# Altium schematic sheet schematic.SchDoc
size Letter
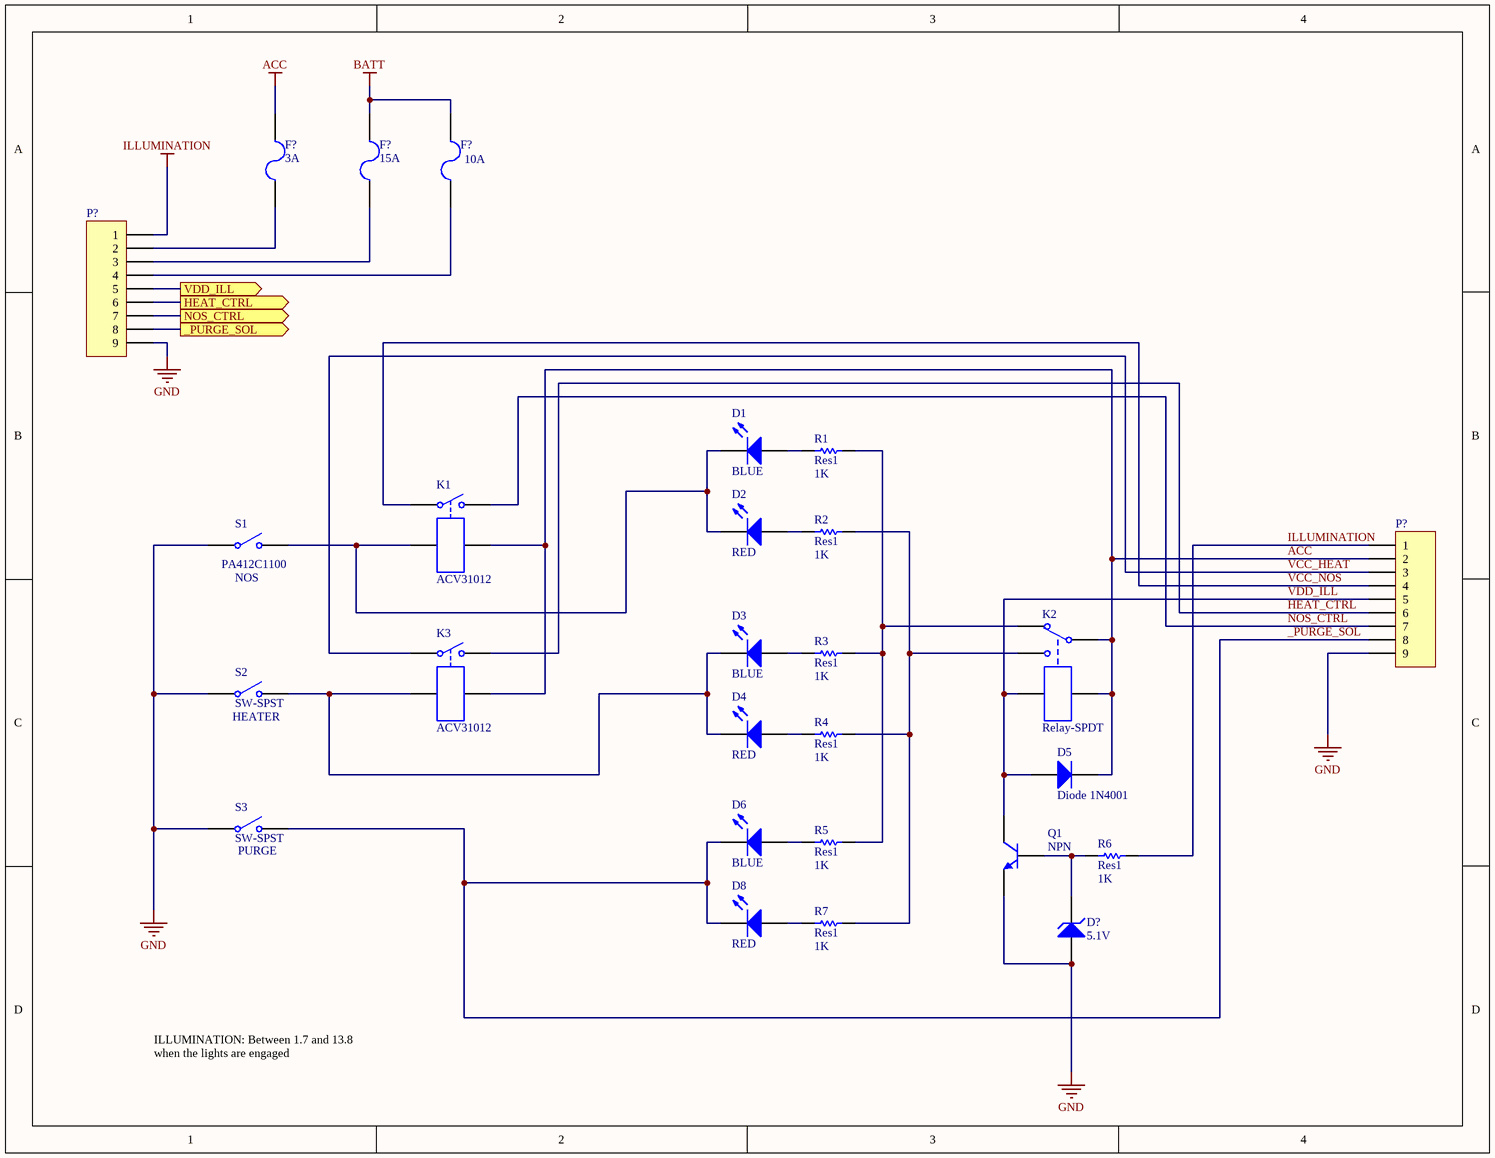
[diagram p0: schematic.SchDoc]

## Parts
(Parts that share a designator on the sheet are numbered #1, #2 ... from top to bottom, then left to right.)
D1  BLUE  [LED-0]
D2  RED  [LED-0]
D3  BLUE  [LED-0]
D4  RED  [LED-0]
D5  Diode 1N4001  [DO-41]
D6  BLUE  [LED-0]
D8  RED  [LED-0]
D?  5.1V  [DIODE-0.7]
F?#1  3A  [PIN-W2/E2.8]
F?#2  15A  [PIN-W2/E2.8]
F?#3  10A  [PIN-W2/E2.8]
K1  ACV31012  [MODULE4]
K2  Relay-SPDT  [MODULE5B]
K3  ACV31012  [MODULE4]
P?#1  (no value)  [HDR1X9]
P?#2  (no value)  [HDR1X9]
Q1  NPN  [TO-226-AA]
R1  Res1  value 1K  [AXIAL-0.3]
R2  Res1  value 1K  [AXIAL-0.3]
R3  Res1  value 1K  [AXIAL-0.3]
R4  Res1  value 1K  [AXIAL-0.3]
R5  Res1  value 1K  [AXIAL-0.3]
R6  Res1  value 1K  [AXIAL-0.3]
R7  Res1  value 1K  [AXIAL-0.3]
S1  PA412C1100  [SPST-2]
S2  SW-SPST  [SPST-2]
S3  SW-SPST  [SPST-2]

## Ports
_PURGE_SOL (out), HEAT_CTRL (out), NOS_CTRL (out), VDD_ILL (out)

## Nets
ACC: D5.2(K) F?#1.2 K1.4 K2.1 K2.4 K3.4 P?#2.2
BATT: F?#2.2 F?#3.2
GND: D?.1(A) P?#1.9 P?#2.9 Q1.3(E) S1.1(COMMON) S2.1(COMMON) S3.1(COMMON)
ILLUMINATION: P?#1.1 P?#2.1 R6.2
_PURGE_SOL: D6.2(K) D8.2(K) P?#2.8 S3.2(NO)
_PURGE_SOL: P?#1.8 ; port _PURGE_SOL  [a separate net that carries the same name]
HEAT_CTRL: K3.2 P?#2.6
HEAT_CTRL: P?#1.6 ; port HEAT_CTRL  [a separate net that carries the same name]
NOS_CTRL: K1.2 P?#2.7
NOS_CTRL: P?#1.7 ; port NOS_CTRL  [a separate net that carries the same name]
VCC_HEAT: K3.1 P?#2.3
VCC_NOS: K1.1 P?#2.4
VDD_ILL: D5.1(A) K2.5 P?#2.5 Q1.1(C)
VDD_ILL: P?#1.5 ; port VDD_ILL  [a separate net that carries the same name]
NetD1_1: D1.1(A) R1.1
NetD1_2: D1.2(K) D2.2(K) K1.3 S1.2(NO)
NetD2_1: D2.1(A) R2.1
NetD3_1: D3.1(A) R3.1
NetD3_2: D3.2(K) D4.2(K) K3.3 S2.2(NO)
NetD4_1: D4.1(A) R4.1
NetD6_1: D6.1(A) R5.1
NetD8_1: D8.1(A) R7.1
NetD?_2: D?.2(K) Q1.2(B) R6.1
NetF?#1_1: F?#1.1 P?#1.2
NetF?#2_1: F?#2.1 P?#1.3
NetF?#3_1: F?#3.1 P?#1.4
NetK2_2: K2.2 R1.2 R3.2 R5.2
NetK2_3: K2.3 R2.2 R4.2 R7.2

## Notes on the sheet
- (near S1) NOS
- (near S2) HEATER
- (near S3) PURGE
- ILLUMINATION: Between 1.7 and 13.8 when the lights are engaged

## Library data of the parts
D1-D4 D6 D8 = LED0: Typical INFRARED GaAs LED; Published: 8-Jun-2000; LatestRevisionDate: 08-Jul-2005; LatestRevisionNote: Mech Layer 1 removed.; PackageReference: LED-0; Publisher: Altium Limited; PackageDescription: LED; 2 Leads
D5 = Diode 1N4001: 1 Amp General Purpose Rectifier; Published: 8-Jun-2000; LatestRevisionDate: 17-Jul-2002; LatestRevisionNote: Re-released for DXP Platform.; DatasheetVersion: 1998; PackageVersion: Aug-1999; PackageReference: DO-41; Publisher: Altium Limited; PackageDescription: Diode, Axial; Body 5.2 x 2.7 mm (LxDia. max), Lead Dia. 0.86 mm (max); Code_JEDEC: DO-204-AL; ComponentLink1Description: Manufacturer Link; ComponentLink1URL: http://www.fairchildsemi.com/; ComponentLink2Description: Datasheet; ComponentLink2URL: http://www.fairchildsemi.com/ds/1N%2F1N4001.pdf
D? = D Zener: Zener Diode; Published: 8-Jun-2000; LatestRevisionDate: 17-Jul-2002; LatestRevisionNote: Re-released for DXP Platform.; PackageReference: DIODE-0.7; Publisher: Altium Limited; PackageDescription: Diode, Thru-Hole; 2 Leads; 0.7 in Pin Spacing
F?#1-F?#3 = Fuse 2: Fuse; Published: 8-Jun-2000; LatestRevisionDate: 17-Jul-2002; LatestRevisionNote: Re-released for DXP Platform.; PackageReference: PIN-W2/E2.8; Publisher: Altium Limited; PackageDescription: Thru-Hole; 2 Leads
K1 K3 = Relay-SPST: Single-Pole Single-Throw Relay; Published: 24-Mar-1999; LatestRevisionDate: 17-Jul-2002; LatestRevisionNote: Re-released for DXP Platform.; PackageReference: MODULE4; Publisher: Altium Limited
K2 = Relay-SPDT: Single-Pole Dual-Throw Relay; Published: 24-Mar-1999; LatestRevisionDate: 17-Jul-2002; LatestRevisionNote: Re-released for DXP Platform.; PackageReference: MODULE5B; Publisher: Altium Limited
P?#1 P?#2 = Header 9: Header, 9-Pin; LatestRevisionDate: 17-Jul-2002; LatestRevisionNote: Re-released for DXP Platform.; Publisher: Altium Limited
Q1 = NPN: NPN Bipolar Transistor; Published: 8-Jun-2000; LatestRevisionDate: 17-Jul-2002; LatestRevisionNote: Re-released for DXP Platform.; PackageReference: TO-226-AA; Publisher: Altium Limited; PackageDescription: TO, Flat Index; 3 In-Line, Axial Leads; Body Dia. 4.8mm; Leads 0.55 x 0.51 mm (max); Code_JEDEC: TO-226-AA
R1-R7 = Res1: Resistor; Published: 8-Jun-2000; LatestRevisionDate: 17-Jul-2002; LatestRevisionNote: Re-released for DXP Platform.; PackageReference: AXIAL-0.3; Publisher: Altium Limited; PackageDescription: Axial Device, Thru-Hole; 2 Leads; 0.3 in Pin Spacing
S1-S3 = SW-SPST: Single-Pole, Single-Throw Switch; Published: 24-Mar-1999; LatestRevisionDate: 17-Jul-2002; LatestRevisionNote: Re-released for DXP Platform.; PackageReference: SPST-2; Publisher: Altium Limited; PackageDescription: Switch; 2 Leads